# Altium schematic sheet dsau-adc-frontend.SchDoc: dSAU Motherboard - ADC Frontend
size Letter; Engineer: Christopher J. Woodall; Organization: Boston University EDF/ECE; DocumentNumber: 4; Revision: A; SheetNumber: 4; SheetTotal: 10; EMAIL: cwoodall@bu.edu; TeamName: Team 19; ProjectName: dSAU
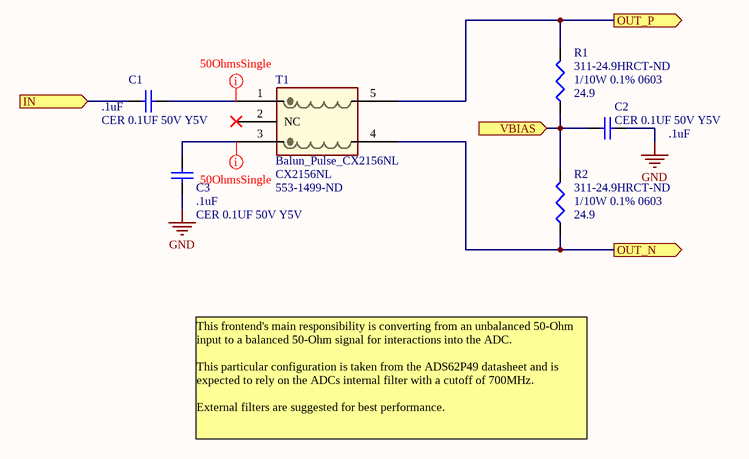
[diagram p0: dsau-adc-frontend.SchDoc]

## Parts
C1  CER 0.1UF 50V Y5V  value .1uF  [CAPC1608L]
C2  CER 0.1UF 50V Y5V  value .1uF  [CAPC1608L]
C3  CER 0.1UF 50V Y5V  value .1uF  [CAPC1608L]
R1  1/10W 0.1% 0603  value 24.9  Supplier Part Number 1: 311-24.9HRCT-ND  [RESC1608L]
R2  1/10W 0.1% 0603  value 24.9  Supplier Part Number 1: 311-24.9HRCT-ND  [RESC1608L]
T1  Balun_Pulse_CX2156NL  Manufacturer Part Number: CX2156NL  Supplier Part Number 1: 553-1499-ND  [CX2156NL_SMD5]

## Ports
IN (in), OUT_N (out), OUT_P (out), VBIAS (in)

## Nets
GND: C2.2 C3.1
IN: C1.1 ; port IN
OUT_N: R2.1 T1.4 ; port OUT_N
OUT_P: R1.2 T1.5 ; port OUT_P
VBIAS: C2.1 R1.1 R2.2 ; port VBIAS
NetC1_2: C1.2 T1.1
NetC3_2: C3.2 T1.3

Not connected (* = marked no-connect by the designer): T1 2(NC)*

## Layout directives
net class 50OhmsSingle: NetC1_2, NetC3_2

## Notes on the sheet
- This frontend's main responsibility is converting from an unbalanced 50-Ohm input to a balanced 50-Ohm signal for interactions into the ADC.
  This particular configuration is taken from the ADS62P49 datasheet and is expected to rely on the ADCs internal filter with a cutoff of 700MHz.
  External filters are suggested for best performance.
- Title
- Size:
- Date:
- Letter
- Number:
- Time:
- Revision:
- Sheet
- of
- File:

## Library data of the parts
C1-C3 = Cap: Capacitor; Manufacturer: Yageo; Manufacturer Part Number: CC0603ZRY5V9BB104; Published: 8-Jun-2000; LatestRevisionDate: 17-Jul-2002; LatestRevisionNote: Re-released for DXP Platform.; PackageReference: RAD-0.3; Publisher: Altium Limited; Supplier 1: Digi-Key; Supplier Part Number 1: 311-1343-1-ND
R1 R2 = Res3: Resistor; Manufacturer: Yageo; Manufacturer Part Number: RC0603FR-0724R9L; Published: 8-Jun-2000; LatestRevisionDate: 29-May-2009; LatestRevisionNote: IPC-7351 Footprint Added.; PackageReference: J1-0603; Publisher: Altium Limited; PackageDescription: Chip Resistor; Supplier 1: Digi-Key
T1 = Balun_Pulse_CX2156NL: TRANSFORMR BALUN 2.3-2700MHZ SMD; Manufacturer: Pulse Electronics Corporation; Supplier 1: Digi-Key